# EAGLE design RS232 (EAGLE 5.06)

## Sheet 1 of 3
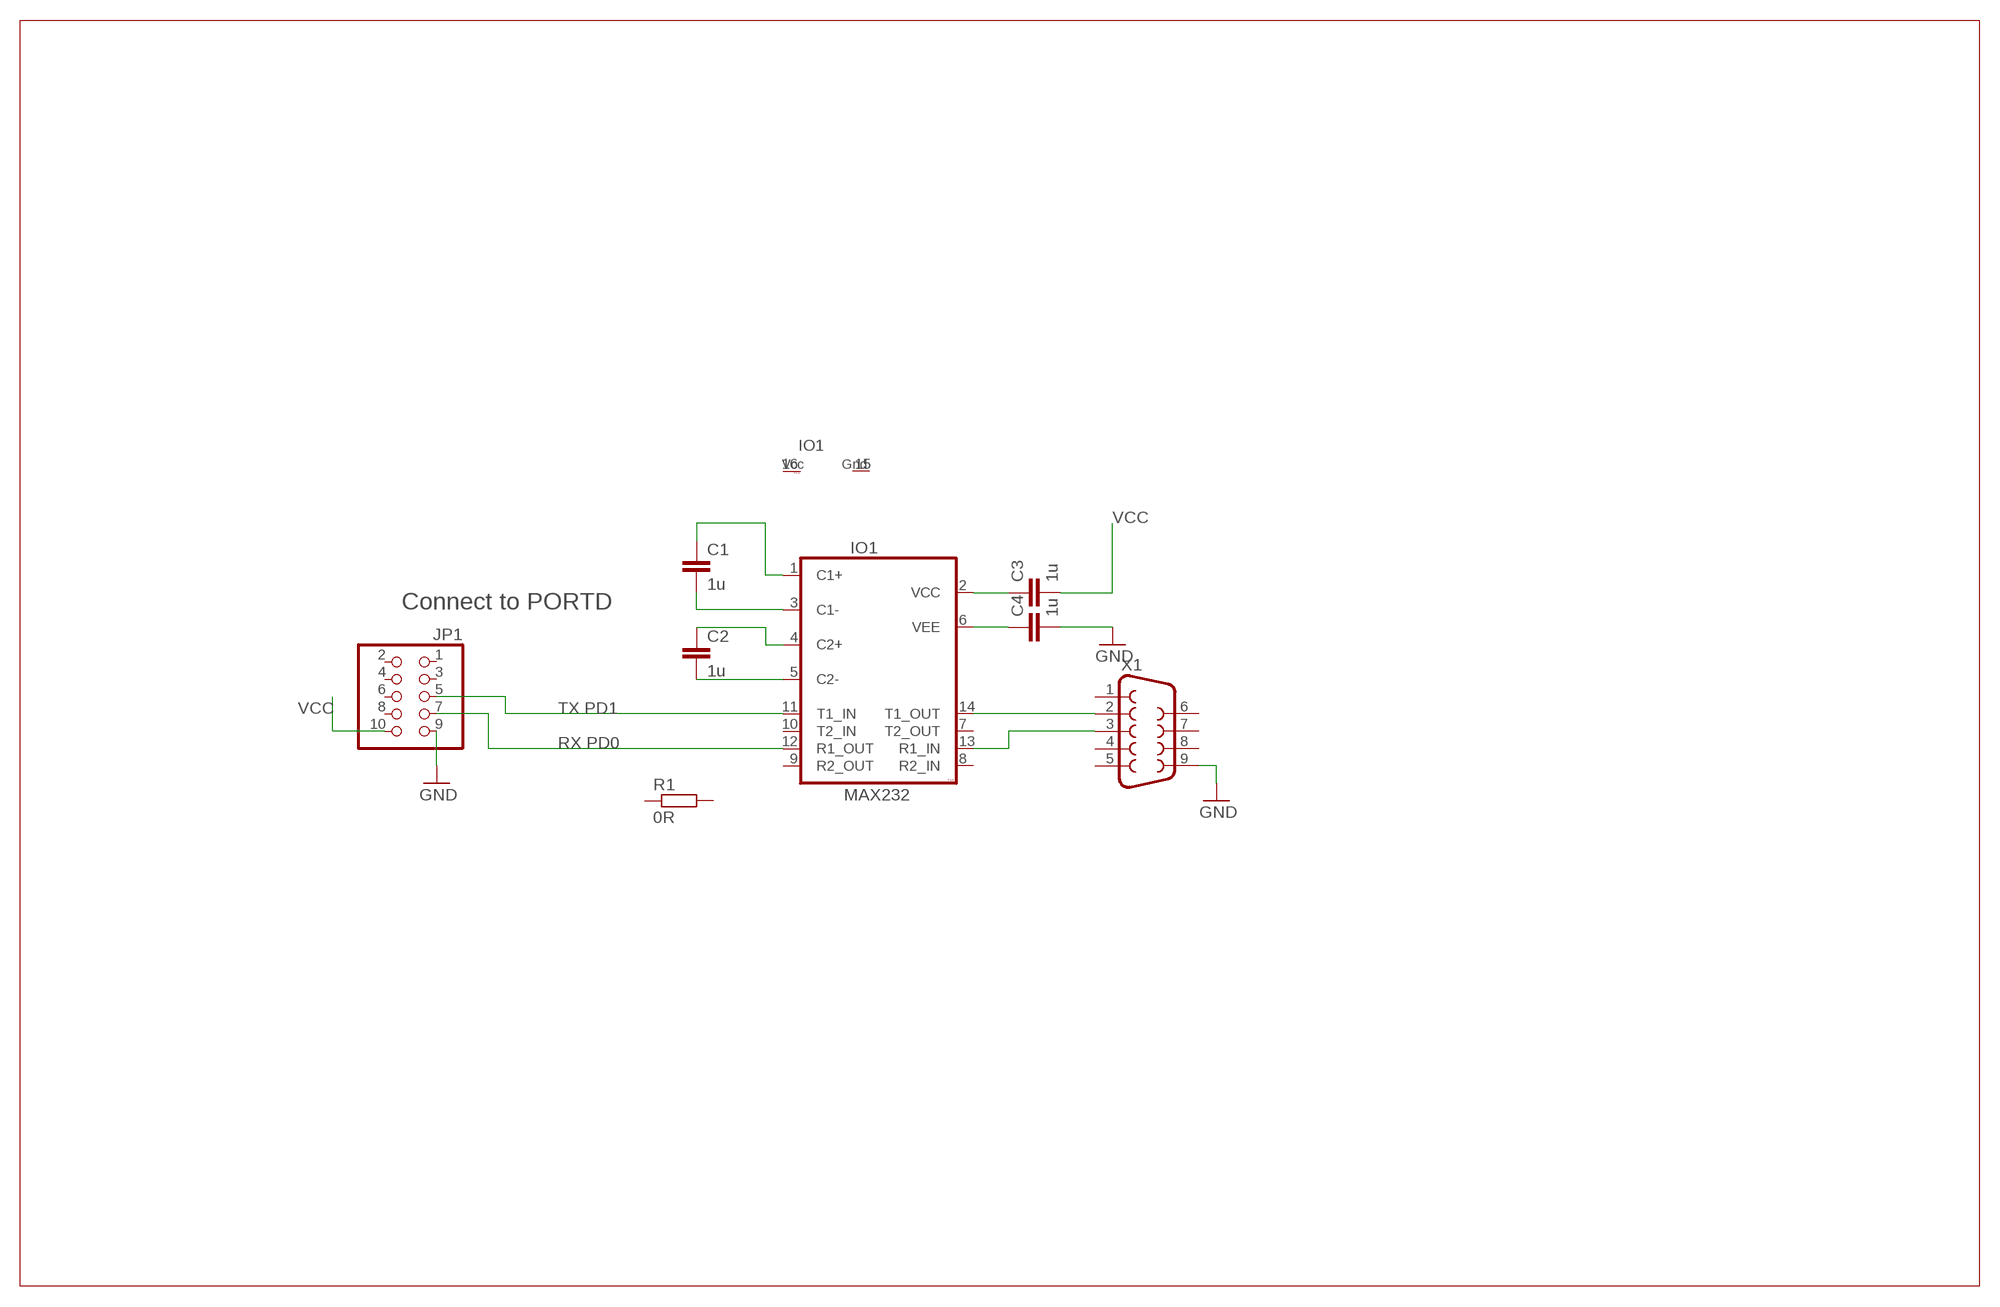
[diagram p0: schematic, sheet 1]

### Parts
C1  1u  C-EUC1206  [C1206]
C2  1u  C-EUC1206  [C1206]
C3  1u  C-EUC1206  [C1206]
C4  1u  C-EUC1206  [C1206]
IO1  MAX232  [DIL16]
JP1  PINHD-2X05_2.54-90°  [2X05/90]
R1  0R  R-EU_0207/10  [0207/10]
X1  F09H  [F09H]

### Nets
GND: C4.2 JP1.9 X1.9
N$1: IO1.12(R1_OUT) JP1.7
N$2: IO1.11(T1_IN) JP1.5
N$3: IO1.14(T1_OUT) X1.2
N$4: IO1.13(R1_IN) X1.3
N$5: C2.1 IO1.4(C2+)
N$6: C2.2 IO1.5(C2-)
N$7: C1.2 IO1.3(C1-)
N$8: C1.1 IO1.1(C1+)
N$9: C3.1 IO1.2(VCC)
N$10: C4.1 IO1.6(VEE)
VCC: C3.2 JP1.10
Unconnected: IO1.7(T2_OUT) IO1.8(R2_IN) IO1.9(R2_OUT) IO1.10(T2_IN) JP1.1 JP1.2 JP1.3 JP1.4 JP1.6 JP1.8 R1.1 R1.2 X1.1 X1.4 X1.5 X1.6 X1.7 X1.8

### Notes on the sheet
- Connect to PORTD
- TX PD1
- RX PD0

## Sheet 2 of 3
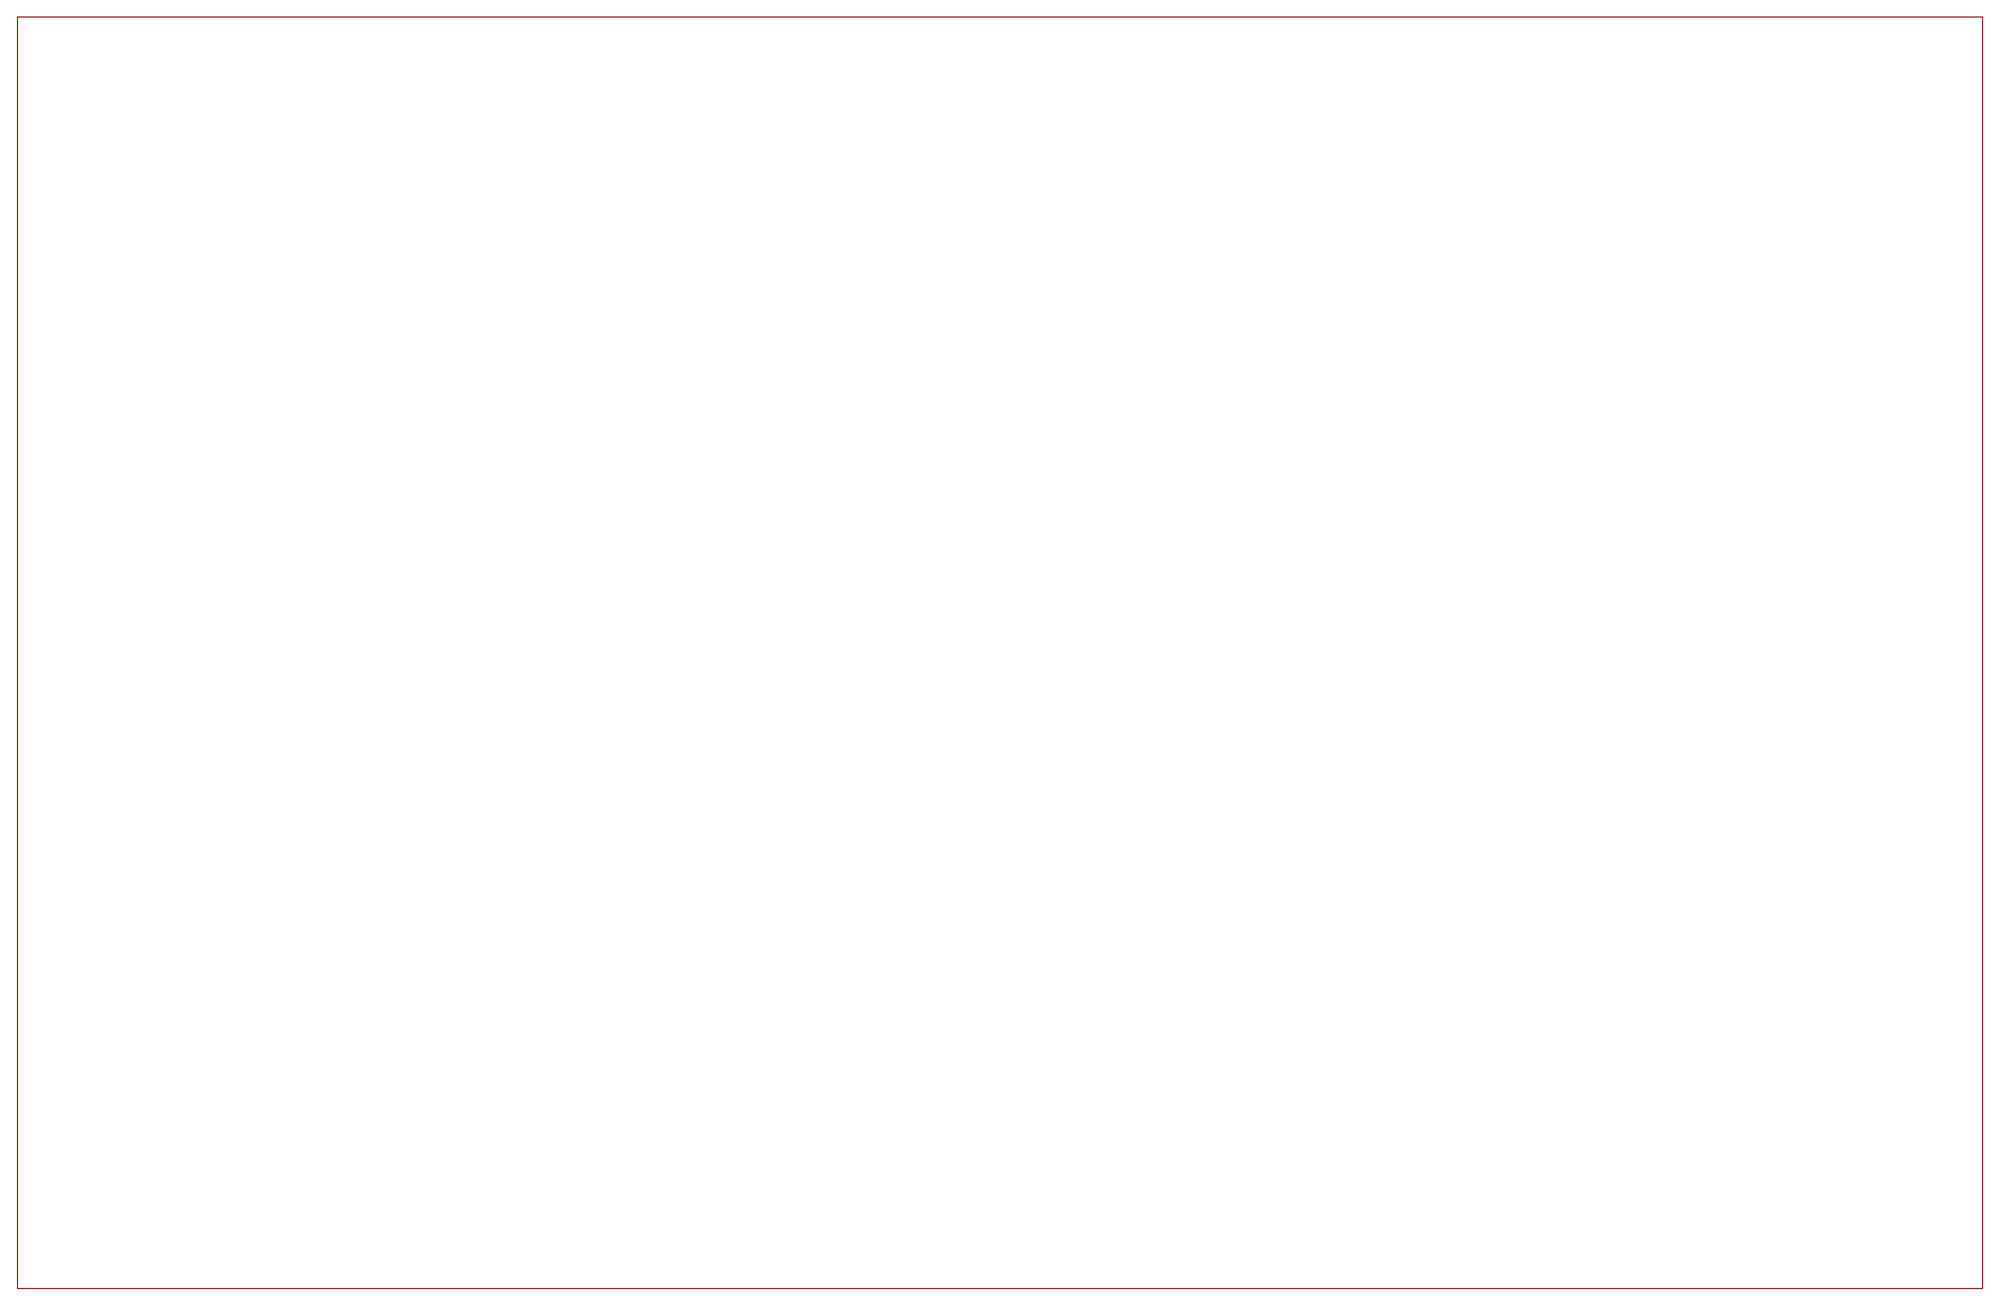
[diagram p1: schematic, sheet 2]

## Sheet 3 of 3
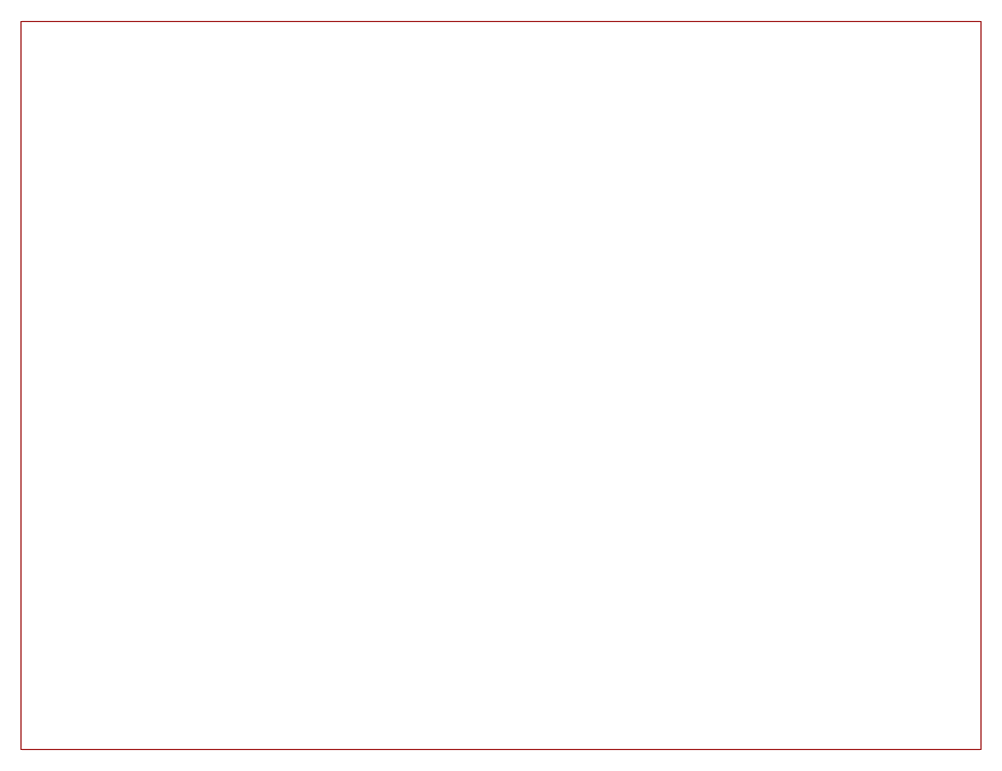
[diagram p2: schematic, sheet 3]

## Power pins joined to a net without a drawn wire
GND: IO1.15(GND)
VCC: IO1.16(VCC)

## Library data of the parts
C1-C4 = resistor:C-EU: CAPACITOR, European symbol
IO1 = #PaJa_30:MAX232: Prevodnik - RS-232 na CMOS/TTL a naopak
JP1 = acon-tyco (19):PINHD-2X05: PIN HEADER
R1 = resistor:R-EU_: RESISTOR, European symbol
X1 = con-subd:F09: SUB-D

## Board
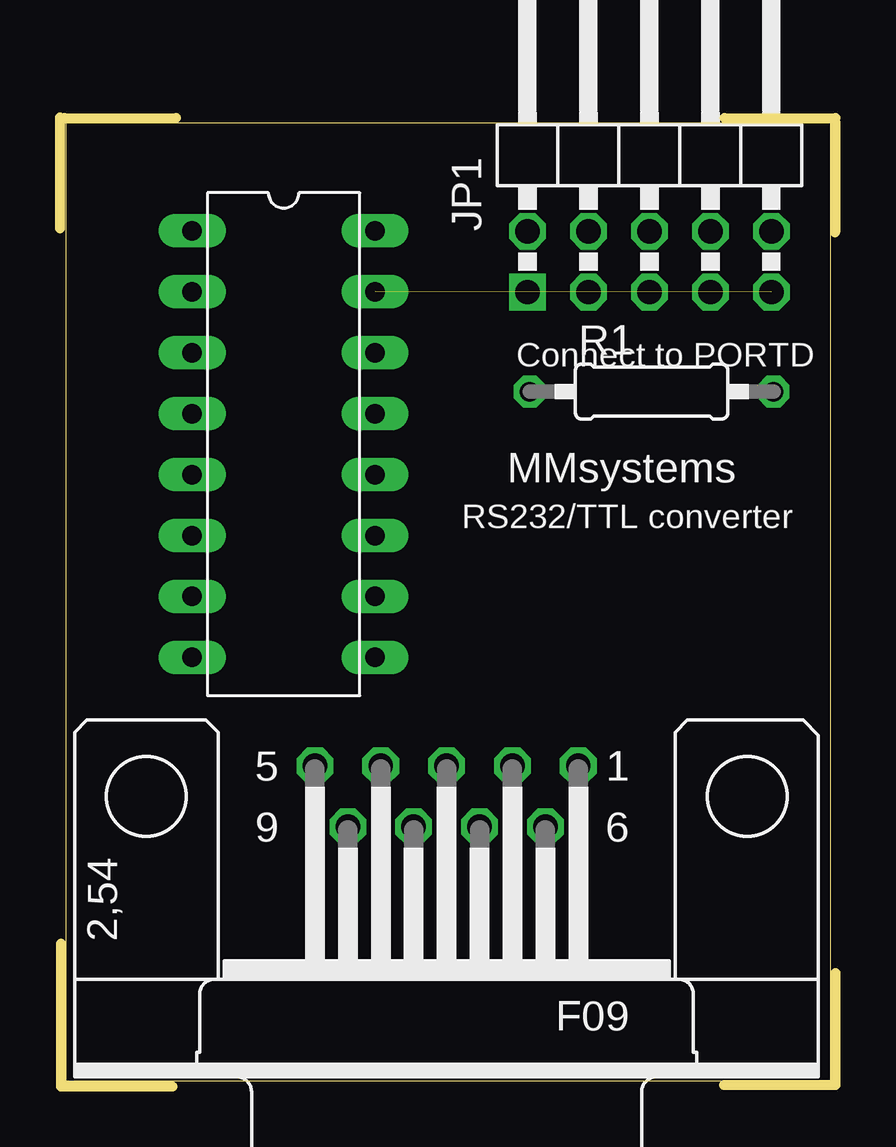
[diagram p3: board, top side]
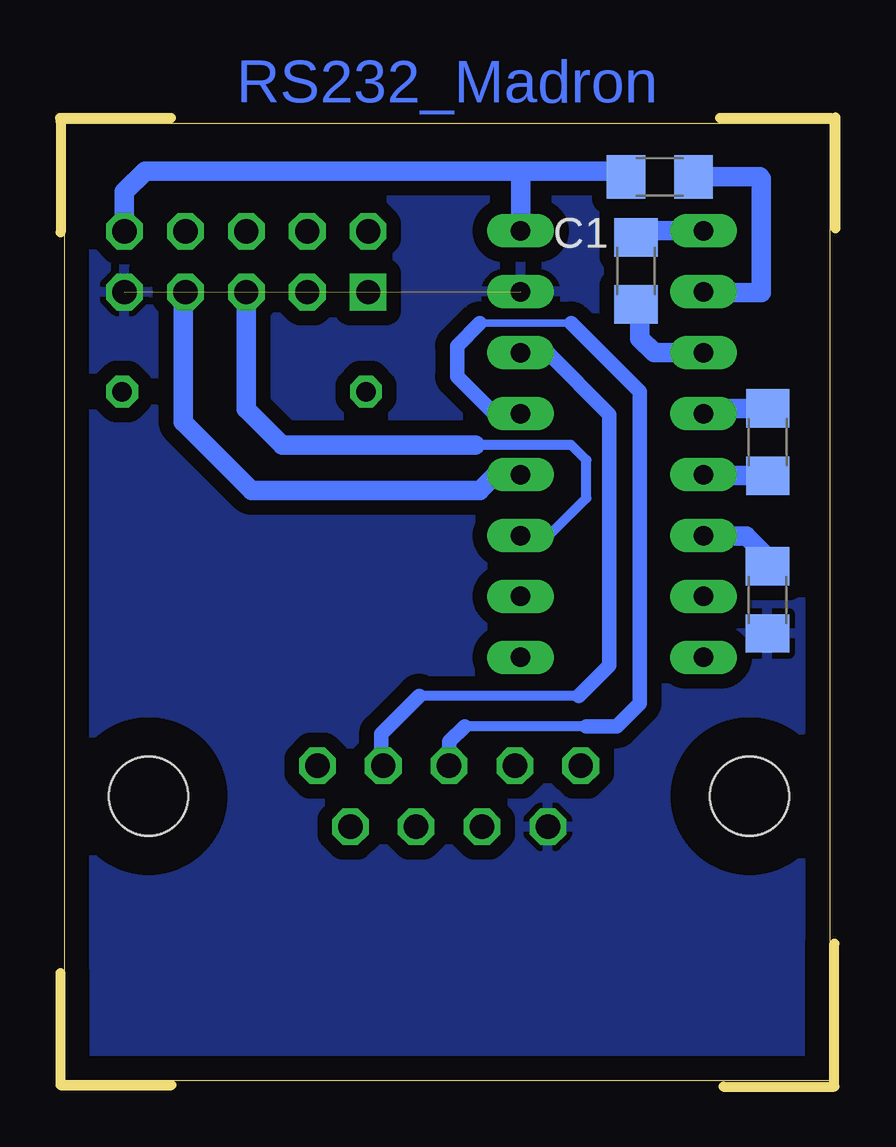
[diagram p4: board, bottom side, seen from below]

Size 32.32 x 40.4 mm. Coordinates in mm from the lower left corner, seen from the top.
Outline: 4.68,0 0.05,0 0.05,5.97
Outline: 32.3,0.06 27.67,0.06
Outline: 32.31,4.74 32.31,0.11
Outline: 32.3,40.24 32.3,35.61
Outline: 27.69,40.37 32.32,40.37
Outline: 0.2,40.37 4.82,40.37
Outline: 0,35.77 0,40.4
Outline: 0.24,40.15 0.24,0.25 32.12,0.25 32.12,40.15 0.24,40.15
Copper layers (1*16): Top 0.035mm / dielectric 1.5mm / Bottom 0.035mm
Design rules "default": minimum track width 10mil, minimum drill 24mil, track to track 8mil, track to pad 8mil, pad to pad 8mil, via to via 8mil, smd to smd 8mil, copper to edge 40mil, drill to drill 8mil, minimum pad ring 10mil, minimum via ring 8mil, stop-mask expansion 4mil, vias tented up to drill 0mil, thermal gap 10mil

### Footprints (pad centres in the part's own frame; a part is rotated, then mirrored left to right if it is on the bottom)
C1206 = smd 1.6 x 1.8: 1 -1.4,0; 2 1.4,0
DIL16 = drill 0.813 pad 1.4 long: 1 -8.89,-3.81; 2 -6.35,-3.81; 3 -3.81,-3.81; 4 -1.27,-3.81; 5 1.27,-3.81; 6 3.81,-3.81; 7 6.35,-3.81; 8 8.89,-3.81; 9 8.89,3.81; 10 6.35,3.81; 11 3.81,3.81; 12 1.27,3.81; 13 -1.27,3.81; 14 -3.81,3.81; 15 -6.35,3.81; 16 -8.89,3.81
2X05/90 = drill 1.016 square: 1 -5.08,-6.35 | drill 1.016 octagon: 2 -5.08,-3.81; 3 -2.54,-6.35; 4 -2.54,-3.81; 5 0,-6.35; 6 0,-3.81; 7 2.54,-6.35; 8 2.54,-3.81; 9 5.08,-6.35; 10 5.08,-3.81
0207/10 = drill 0.813 octagon: 1 -5.08,0; 2 5.08,0
F09H = drill 1.016 octagon: 1 -5.486,-1.27; 2 -2.743,-1.27; 3 0,-1.27; 4 2.743,-1.27; 5 5.486,-1.27; 6 -4.115,1.27; 7 -1.372,1.27; 8 1.372,1.27; 9 4.115,1.27 | hole 3.302: -12.522,0; 12.522,0

### Placement (x,y rotation side)
C1  8.32,34.01 270 bottom
C2  2.83,26.87 270 bottom
C3  7.33,37.93 180 bottom
C4  2.84,20.29 270 bottom
IO1  9.32,26.78 270 top
JP1  24.56,39.47 0 top
R1  24.65,28.97 0 top
X1  16.11,12.1 180 top

### Tracks (layer width: path | path; a pad name or v marks a point on that pad's centre or on a via)
GND  (1 unrouted)
  pour Bottom (isolate 0.61): -3.19,42.65 -2.56,-2.47 34.25,-2.47 34.25,42.65
N$1
  Bottom 0.406: 27.19,33.03 27.19,32.46
  Bottom 0.813: IO1.12 14.16,25.51 14.82,24.85 24.33,24.85 27.19,27.71 27.19,33.03 JP1.7
N$2
  Bottom 0.406: IO1.11 11.95,22.97 10.39,24.54 10.39,26.12 11.02,26.75 15.02,26.75
  Bottom 0.813: JP1.5 24.56,28.25 23.07,26.75 15.02,26.75
N$3
  Bottom 0.406: 12.32,30.59 IO1.14 | 10.7,16.29 17.36,16.29 | 18.94,13.47 X1.2
  Bottom 0.61: 17.36,16.29 18.94,14.71 18.94,13.47 | 12.32,30.59 12.01,30.59 9.43,28.02 9.43,17.56 10.7,16.29
N$4
  Bottom 0.305: 11.02,31.83 14.82,31.83
  Bottom 0.406: 14.22,28.05 IO1.13 | 10.39,15.03 15.46,15.03 | 16.09,13.39 X1.3
  Bottom 0.61: 14.22,28.05 15.77,29.61 15.77,30.88 14.82,31.83 | 15.46,15.03 16.09,14.39 16.09,13.39 | 11.02,31.83 8.17,28.97 8.17,15.98 9.12,15.03 10.39,15.03
N$5
  Bottom 0.813: C2.1 5.29,28.27 IO1.4
N$6
  Bottom 0.813: C2.2 5.46,25.47 IO1.5
N$7
  Bottom 0.813: IO1.3 7.57,30.59 8.17,31.19 8.17,31.82 C1.2
N$8
  Bottom 0.813: IO1.1 8.05,35.67 C1.1
N$9
  Bottom 0.61: 3.09,37.85 3.17,37.93
  Bottom 0.813: 3.17,37.93 C3.1 | 3.09,37.85 3.09,33.09 5.47,33.09 IO1.2
N$10
  Bottom 0.813: C4.1 2.53,21.75 3.73,22.95 5.49,22.95 IO1.6
VCC
  Bottom 0.813: JP1.10 29.64,37.3 28.77,38.17 13.24,38.17 | 13.24,38.17 8.97,38.17 C3.2 | IO1.16 13.13,38.06 13.24,38.17

### Text on the board
Bottom: RS232_Madron
tNames: Connect to PORTD | MMsystems | RS232/TTL converter